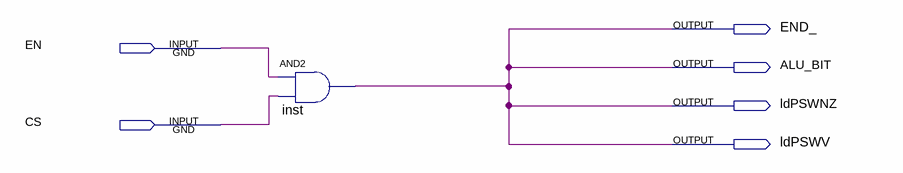
[diagram p0: schematic sheet]
// Quartus schematic BIT.bdf as structural Verilog: 1 symbols, 6 pins
module BIT (
  input  EN,
  input  CS,
  output END_,
  output ALU_BIT,
  output ldPSWNZ,
  output ldPSWV
);

  and inst (ALU_BIT, EN, CS);

  assign END_ = ALU_BIT;
  assign ldPSWNZ = ALU_BIT;
  assign ldPSWV = ALU_BIT;
endmodule
